# Altium schematic sheet STRWHL-S01-V00-SteeringWheel.SchDoc: Steering Wheel 2020
size A3; DrawnBy: Jonn Dillon; DocumentNumber: 1; Revision: 00; SheetNumber: 1; SheetTotal: 9; Project: Steering Wheel 2020
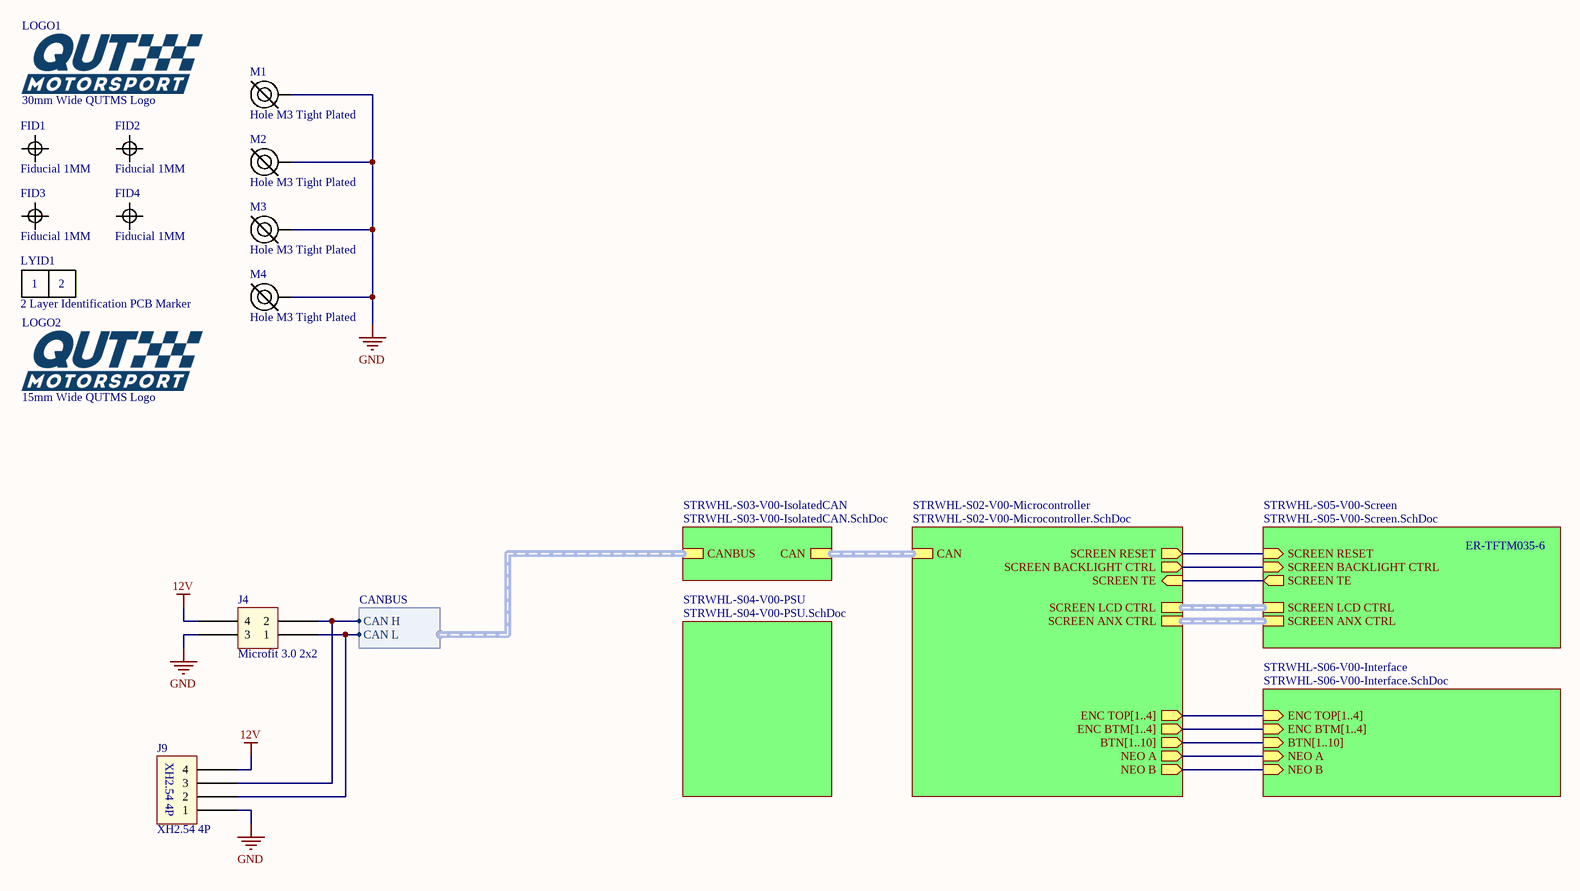
[diagram p0: STRWHL-S01-V00-SteeringWheel.SchDoc]

## Parts
FID1  Fiducial 1MM  [FIDUCIAL 1MM]
FID2  Fiducial 1MM  [FIDUCIAL 1MM]
FID3  Fiducial 1MM  [FIDUCIAL 1MM]
FID4  Fiducial 1MM  [FIDUCIAL 1MM]
J4  Microfit 3.0 2x2  [Microfit_2X2_R_TH]
J9  XH2.54 4P  [JST_XH254_4P_TH_RH]
LOGO1  30mm Wide QUTMS Logo  [QUTMS LOGO 30MM]
LOGO2  15mm Wide QUTMS Logo  [QUTMS LOGO 15MM]
LYID1  2 Layer Identification PCB Marker  [LAYER IDENT 2]
M1  Hole M3 Tight Plated  [M3.2 PLATED]
M2  Hole M3 Tight Plated  [M3.2 PLATED]
M3  Hole M3 Tight Plated  [M3.2 PLATED]
M4  Hole M3 Tight Plated  [M3.2 PLATED]

## Sub-sheets
STRWHL-S02-V00-Microcontroller = STRWHL-S02-V00-Microcontroller.SchDoc: SCREEN LCD CTRL (harness SCREEN LCD CTRL), SCREEN ANX CTRL (harness SCREEN ANX CTRL), SCREEN TE (in), SCREEN BACKLIGHT CTRL (out), SCREEN RESET (out), CAN (harness CAN), ENC TOP[1..4] (out), ENC BTM[1..4] (out), BTN[1..10] (out), NEO A (out), NEO B (out)
STRWHL-S03-V00-IsolatedCAN = STRWHL-S03-V00-IsolatedCAN.SchDoc: CANBUS (harness CANBUS), CAN (harness CAN)
STRWHL-S04-V00-PSU = STRWHL-S04-V00-PSU.SchDoc: no entries
STRWHL-S05-V00-Screen = STRWHL-S05-V00-Screen.SchDoc: SCREEN ANX CTRL (harness SCREEN ANX CTRL), SCREEN LCD CTRL (harness SCREEN LCD CTRL), SCREEN TE (out), SCREEN BACKLIGHT CTRL (in), SCREEN RESET (in)
STRWHL-S06-V00-Interface = STRWHL-S06-V00-Interface.SchDoc: BTN[1..10] (in), ENC TOP[1..4] (in), NEO B (in), ENC BTM[1..4] (in), NEO A (in)

## Harnesses
CANBUS: CAN H, CAN L

## Nets
12V: J4.4 J9.4
GND: J4.3 J9.1 M1.1 M2.1 M3.1 M4.1
NetJ4_1: J4.1 J9.2 ; sheet STRWHL-S03-V00-IsolatedCAN/CANBUS.CAN L
NetJ4_2: J4.2 J9.3 ; sheet STRWHL-S03-V00-IsolatedCAN/CANBUS.CAN H
(unnamed): sheet STRWHL-S02-V00-Microcontroller/SCREEN TE, sheet STRWHL-S05-V00-Screen/SCREEN TE
(unnamed): sheet STRWHL-S02-V00-Microcontroller/SCREEN BACKLIGHT CTRL, sheet STRWHL-S05-V00-Screen/SCREEN BACKLIGHT CTRL
(unnamed): sheet STRWHL-S02-V00-Microcontroller/SCREEN RESET, sheet STRWHL-S05-V00-Screen/SCREEN RESET
(unnamed): sheet STRWHL-S02-V00-Microcontroller/NEO A, sheet STRWHL-S06-V00-Interface/NEO A
(unnamed): sheet STRWHL-S02-V00-Microcontroller/NEO B, sheet STRWHL-S06-V00-Interface/NEO B

## Buses and harness runs
bus sheet STRWHL-S02-V00-Microcontroller/BTN[1..10] = sheet STRWHL-S06-V00-Interface/BTN[1..10]
bus sheet STRWHL-S02-V00-Microcontroller/ENC BTM[1..4] = sheet STRWHL-S06-V00-Interface/ENC BTM[1..4]
bus sheet STRWHL-S02-V00-Microcontroller/ENC TOP[1..4] = sheet STRWHL-S06-V00-Interface/ENC TOP[1..4]
harness sheet STRWHL-S02-V00-Microcontroller/CAN = sheet STRWHL-S03-V00-IsolatedCAN/CAN
harness sheet STRWHL-S02-V00-Microcontroller/SCREEN ANX CTRL = sheet STRWHL-S05-V00-Screen/SCREEN ANX CTRL
harness sheet STRWHL-S02-V00-Microcontroller/SCREEN LCD CTRL = sheet STRWHL-S05-V00-Screen/SCREEN LCD CTRL

## Notes on the sheet
- ER-TFTM035-6
- Revision History:
- Sheet Title:
- Rev
- Date
- Description
- Project:
- Size:
- Drawn By:
- A3
- Number:
- Revision:
- Sheet
- Version:
- of
- QUT Motorsport
- O-120, Gardens Point
- 2 George Street
- Brisbane, QLD 4000
- Australia
- Print Date:
- Print Time:
- File Name:
- (in symbol Layer Identification 2) 1; 2

## Library data of the parts
J4 = Microfit_2x2
LOGO1 = QUTMS Logo 30mm
LOGO2 = QUTMS Logo 15mm
LYID1 = Layer Identification 2
M1-M4 = Hole M3 Tight Plated: M3.2 Hole, Plated